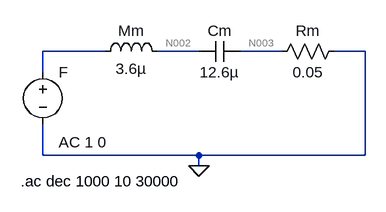
[diagram p0: schematic ex3_diafragma_tensionado.asc]
ex3_diafragma_tensionado.asc, the LTspice schematic file:
Version 4
SHEET 1 880 680
WIRE 32 80 -64 80
WIRE 176 80 112 80
WIRE 304 80 240 80
WIRE 432 80 384 80
WIRE -64 112 -64 80
WIRE -64 240 -64 192
WIRE 176 240 -64 240
WIRE 432 240 432 80
WIRE 432 240 176 240
WIRE 176 256 176 240
FLAG 176 256 0
SYMBOL voltage -64 96 R0
WINDOW 123 24 124 Left 2
WINDOW 39 0 0 Left 0
SYMATTR Value2 AC 1 0
SYMATTR InstName F
SYMATTR Value ""
SYMBOL ind 16 96 R270
WINDOW 0 32 56 VTop 2
WINDOW 3 5 56 VBottom 2
SYMATTR InstName Mm
SYMATTR Value 3.6µ
SYMBOL cap 240 64 R90
WINDOW 0 0 32 VBottom 2
WINDOW 3 32 32 VTop 2
SYMATTR InstName Cm
SYMATTR Value 12.6µ
SYMBOL res 400 64 R90
WINDOW 0 0 56 VBottom 2
WINDOW 3 32 56 VTop 2
SYMATTR InstName Rm
SYMATTR Value 0.05
TEXT -98 280 Left 2 !.ac dec 1000 10 30000

The netlist it stands for:
* ex3_diafragma_tensionado.asc
V§F N001 0 AC 1 0
L§Mm N001 N002 3.6µ
Cm N003 N002 12.6µ
Rm 0 N003 0.05
.ac dec 1000 10 30000
.backanno
.end

* Results of the author's LTspice run, read from the files saved beside the schematic
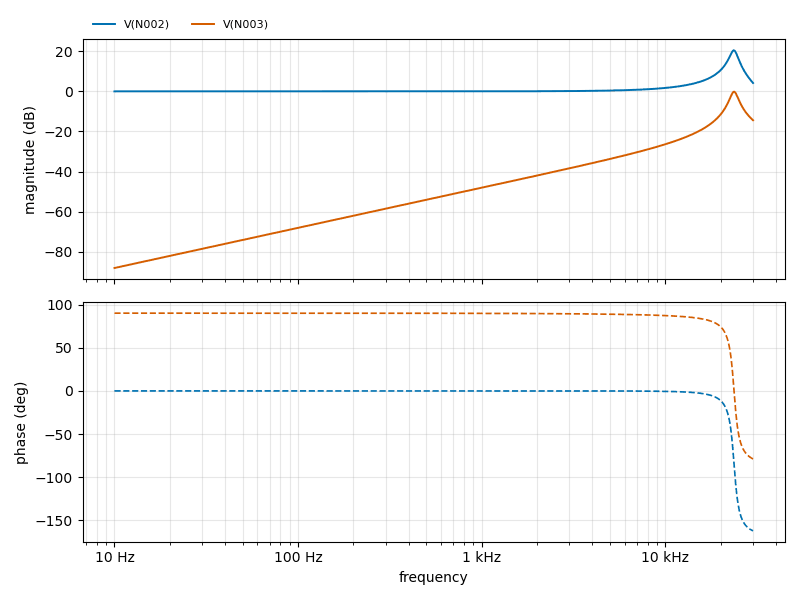
[diagram p1: AC Analysis of ex3_diafragma_tensionado.asc, plotted from the saved traces]
* AC Analysis, 1 run:
*   V(N002): 0.00 dB at 10 Hz, 4.16 dB at 30 kHz, peak 20.45 dB at 23.6 kHz, 3 dB below the peak at 22.42 kHz and 24.68 kHz
*   V(N003): -88.05 dB at 10 Hz, -14.40 dB at 30 kHz, peak -0.17 dB at 23.6 kHz, 3 dB below the peak at 22.53 kHz and 24.79 kHz